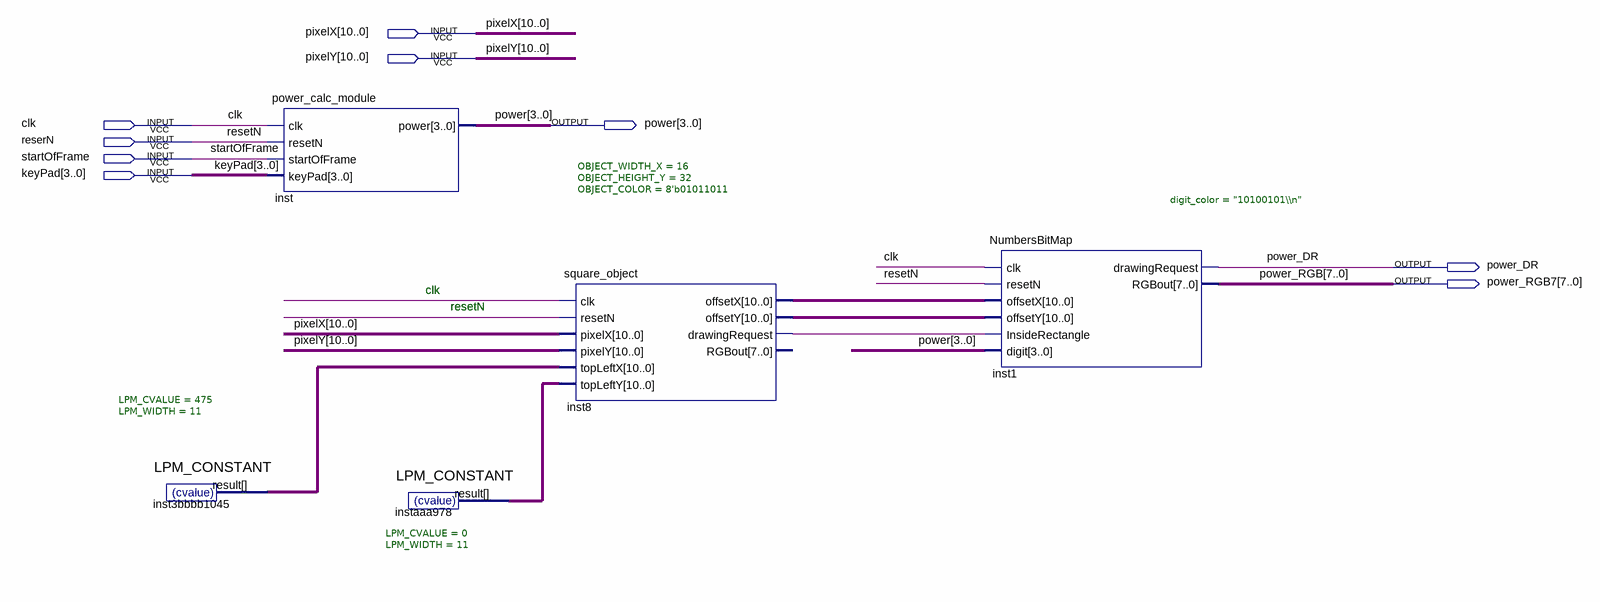
[diagram p0: schematic sheet]
// Quartus schematic Power_Calc_Block.bdf as structural Verilog: 5 symbols, 9 pins
module Power_Calc_Block (
  input  [10:0] pixelX,
  input  [10:0] pixelY,
  input  clk,
  input  reserN,
  input  startOfFrame,
  input  [3:0] keyPad,
  output [3:0] power,
  output power_DR,
  output [7:0] power_RGB7
);

  wire inst8_drawingrequest;
  wire [10:0] inst3bbbb1045_result, inst8_offsetx, inst8_offsety, instaaa978_result;

  LPM_CONSTANT #(.LPM_CVALUE(475), .LPM_WIDTH(11)) inst3bbbb1045 (.result(inst3bbbb1045_result));
  power_calc_module inst (.clk(clk), .resetN(reserN), .startOfFrame(startOfFrame), .keyPad(keyPad), .power(power));
  LPM_CONSTANT #(.LPM_CVALUE(0), .LPM_WIDTH(11)) instaaa978 (.result(instaaa978_result));
  square_object #(.OBJECT_WIDTH_X(16), .OBJECT_HEIGHT_Y(32), .OBJECT_COLOR(8'b01011011)) inst8 (
    .clk(clk), .resetN(reserN), .pixelX(pixelX), .pixelY(pixelY), .topLeftX(inst3bbbb1045_result),
    .topLeftY(instaaa978_result), .offsetX(inst8_offsetx), .offsetY(inst8_offsety),
    .drawingRequest(inst8_drawingrequest));  // open: RGBout
  NumbersBitMap #(.digit_color("10100101\\n")) inst1 (
    .clk(clk), .resetN(reserN), .offsetX(inst8_offsetx), .offsetY(inst8_offsety),
    .InsideRectangle(inst8_drawingrequest), .digit(power), .drawingRequest(power_DR), .RGBout(power_RGB7));

  // Other names for the same wires on the sheet: power_RGB[7:0] = power_RGB7; resetN = reserN

  // Notes on the sheet:
  //   clk
  //   resetN
endmodule
